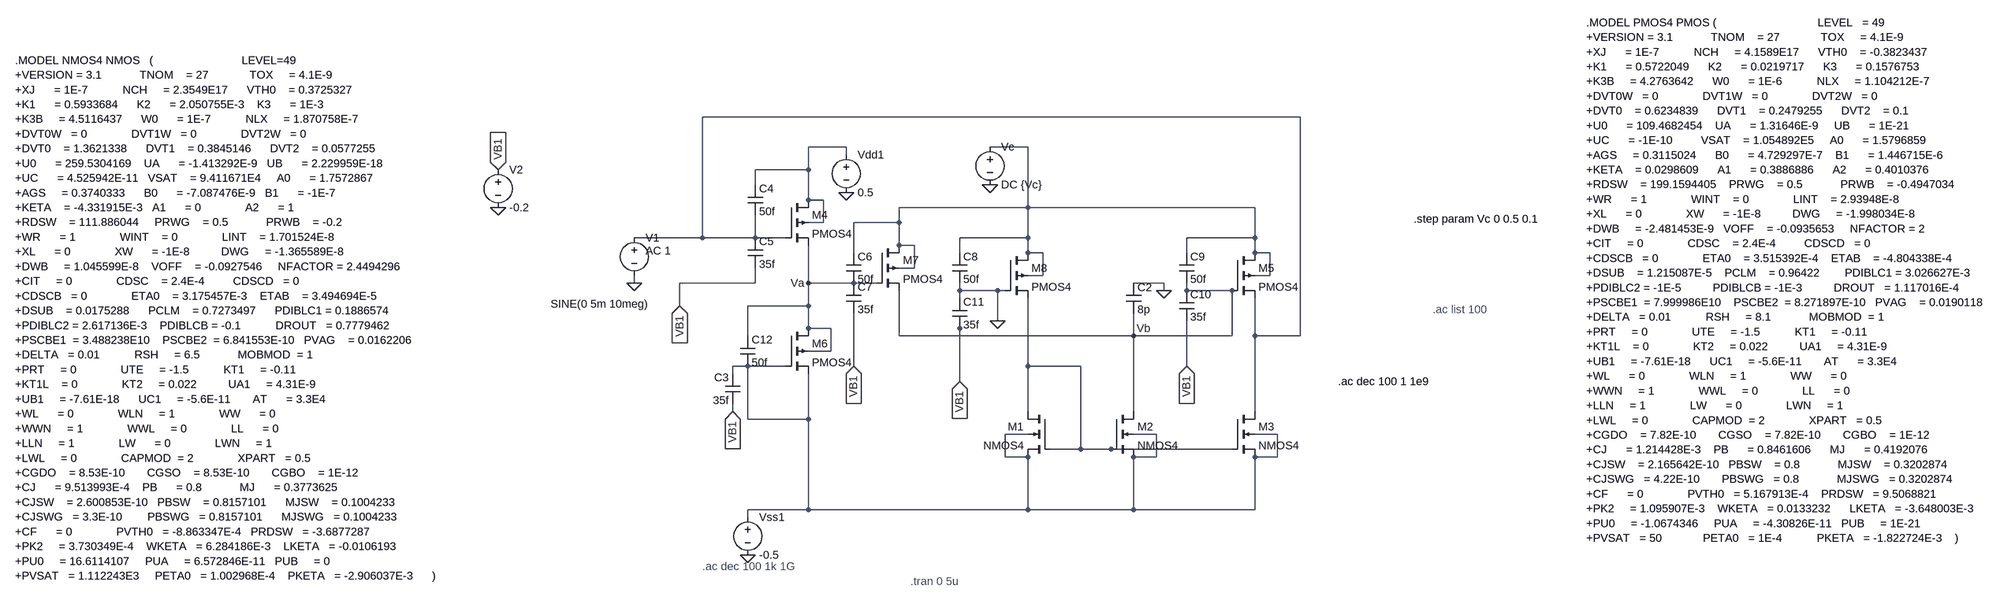
[diagram p0: schematic BPFilter_fgmos_tran.asc]
BPFilter_fgmos_tran.asc, the LTspice schematic file:
Version 4.1
SHEET 1 3080 808
WIRE 1280 -192 16 -192
WIRE 320 -128 240 -128
WIRE 704 -128 624 -128
WIRE 320 -112 320 -128
WIRE 240 -80 240 -128
WIRE 240 -80 128 -80
WIRE 128 -48 128 -80
WIRE 240 -16 240 -80
WIRE 272 -16 240 -16
WIRE 704 0 704 -128
WIRE 704 0 432 0
WIRE 1184 0 704 0
WIRE 272 32 272 -16
WIRE 272 32 240 32
WIRE 432 32 432 0
WIRE 432 32 336 32
WIRE 16 64 16 -192
WIRE 16 64 -128 64
WIRE 128 64 128 16
WIRE 128 64 16 64
WIRE 192 64 128 64
WIRE 704 64 704 0
WIRE 704 64 560 64
WIRE 1184 64 1184 0
WIRE 1184 64 1040 64
WIRE 432 80 432 32
WIRE 464 80 432 80
WIRE 336 96 336 32
WIRE 560 96 560 64
WIRE 704 96 704 64
WIRE 736 96 704 96
WIRE 1040 96 1040 64
WIRE 1184 96 1184 64
WIRE 1216 96 1184 96
WIRE 464 128 464 80
WIRE 464 128 432 128
WIRE 736 144 736 96
WIRE 736 144 704 144
WIRE 1216 144 1216 96
WIRE 1216 144 1184 144
WIRE -128 160 -128 144
WIRE 128 160 128 128
WIRE 128 160 -32 160
WIRE 240 160 240 80
WIRE 336 160 240 160
WIRE 384 160 336 160
WIRE 992 160 928 160
WIRE 560 176 560 160
WIRE 640 176 560 176
WIRE 656 176 640 176
WIRE 992 176 992 160
WIRE 1040 176 1040 160
WIRE 1136 176 1040 176
WIRE 560 192 560 176
WIRE -32 208 -32 160
WIRE 240 208 240 160
WIRE 240 208 112 208
WIRE 640 240 640 176
WIRE 240 256 240 208
WIRE 288 256 240 256
WIRE 560 256 560 240
WIRE 112 272 112 208
WIRE 432 272 432 176
WIRE 928 272 928 224
WIRE 928 272 432 272
WIRE 1136 272 1136 176
WIRE 1136 272 928 272
WIRE 1184 272 1184 192
WIRE 1280 272 1280 -192
WIRE 1280 272 1184 272
WIRE 288 304 288 256
WIRE 288 304 240 304
WIRE 112 336 80 336
WIRE 192 336 112 336
WIRE 336 336 336 224
WIRE 704 336 704 192
WIRE 816 336 704 336
WIRE 1040 336 1040 240
WIRE 80 352 80 336
WIRE 560 368 560 256
WIRE 80 432 80 416
WIRE 704 432 704 336
WIRE 928 432 928 272
WIRE 1184 432 1184 272
WIRE 112 448 112 336
WIRE 240 448 240 352
WIRE 240 448 112 448
WIRE 704 480 656 480
WIRE 976 480 928 480
WIRE 1232 480 1184 480
WIRE 816 512 816 336
WIRE 816 512 752 512
WIRE 880 512 816 512
WIRE 1136 512 880 512
WIRE 656 528 656 480
WIRE 704 528 656 528
WIRE 976 528 976 480
WIRE 976 528 928 528
WIRE 1232 528 1232 480
WIRE 1232 528 1184 528
WIRE 240 640 240 448
WIRE 240 640 112 640
WIRE 704 640 704 528
WIRE 704 640 240 640
WIRE 928 640 928 528
WIRE 928 640 704 640
WIRE 1184 640 1184 528
WIRE 1184 640 928 640
WIRE 112 656 112 640
FLAG 112 736 0
FLAG -128 160 0
FLAG 320 -32 0
FLAG 624 -48 0
FLAG 240 160 Va
FLAG 928 272 Vb
FLAG 992 176 0
FLAG -416 0 0
FLAG -416 -80 VB1
IOPIN -416 -80 In
FLAG -32 208 VB1
IOPIN -32 208 In
FLAG 80 432 VB1
IOPIN 80 432 In
FLAG 336 336 VB1
IOPIN 336 336 In
FLAG 560 368 VB1
IOPIN 560 368 In
FLAG 1040 336 VB1
IOPIN 1040 336 In
FLAG 640 240 0
SYMBOL nmos4 752 432 M0
SYMATTR InstName M1
SYMATTR Value2 l=1u w=10u
SYMATTR Value NMOS4
SYMBOL nmos4 880 432 R0
SYMATTR InstName M2
SYMATTR Value2 l=1u w=10u
SYMATTR Value NMOS4
SYMBOL nmos4 1136 432 R0
SYMATTR InstName M3
SYMATTR Value2 l=1u w=10u
SYMATTR Value NMOS4
SYMBOL voltage 112 640 R0
WINDOW 123 0 0 Left 0
WINDOW 39 0 0 Left 0
SYMATTR InstName Vss1
SYMATTR Value -0.5
SYMBOL voltage -128 48 R0
WINDOW 123 24 44 Left 2
WINDOW 39 0 0 Left 0
WINDOW 3 -177 156 Left 2
SYMATTR Value2 AC 1
SYMATTR Value SINE(0 5m 10meg)
SYMATTR InstName V1
SYMBOL pmos4 192 -16 R0
SYMATTR InstName M4
SYMATTR Value2 l=0.5u w=5u
SYMATTR Value PMOS4
SYMBOL pmos4 1136 96 R0
SYMATTR InstName M5
SYMATTR Value2 l=0.5u w=20u
SYMATTR Value PMOS4
SYMBOL voltage 320 -128 R0
WINDOW 123 0 0 Left 0
WINDOW 39 0 0 Left 0
SYMATTR InstName Vdd1
SYMATTR Value 0.5
SYMBOL pmos4 192 256 R0
SYMATTR InstName M6
SYMATTR Value2 l=0.5u w=5u
SYMATTR Value PMOS4
SYMBOL pmos4 384 80 R0
SYMATTR InstName M7
SYMATTR Value2 l=0.5u w=20u
SYMATTR Value PMOS4
SYMBOL pmos4 656 96 R0
SYMATTR InstName M8
SYMATTR Value2 l=0.5u w=20u
SYMATTR Value PMOS4
SYMBOL voltage 624 -144 R0
WINDOW 123 0 0 Left 0
WINDOW 39 0 0 Left 0
SYMATTR InstName Vc
SYMATTR Value DC {Vc}
SYMBOL cap 912 160 R0
WINDOW 0 24 9 Left 2
SYMATTR InstName C2
SYMATTR Value 8p
SYMBOL voltage -416 -96 R0
WINDOW 123 0 0 Left 0
WINDOW 39 0 0 Left 0
SYMATTR InstName V2
SYMATTR Value -0.2
SYMBOL cap 96 416 R180
WINDOW 0 24 56 Left 2
WINDOW 3 24 8 Left 2
SYMATTR InstName C3
SYMATTR Value 35f
SYMBOL cap 112 -48 R0
SYMATTR InstName C4
SYMATTR Value 50f
SYMBOL cap 112 64 R0
SYMATTR InstName C5
SYMATTR Value 35f
SYMBOL cap 320 96 R0
SYMATTR InstName C6
SYMATTR Value 50f
SYMBOL cap 320 160 R0
SYMATTR InstName C7
SYMATTR Value 35f
SYMBOL cap 544 96 R0
SYMATTR InstName C8
SYMATTR Value 50f
SYMBOL cap 1024 96 R0
SYMATTR InstName C9
SYMATTR Value 50f
SYMBOL cap 1024 176 R0
SYMATTR InstName C10
SYMATTR Value 35f
SYMBOL cap 544 192 R0
SYMATTR InstName C11
SYMATTR Value 35f
SYMBOL cap 96 272 R0
SYMATTR InstName C12
SYMATTR Value 50f
TEXT 16 760 Left 2 ;.ac dec 100 1k 1G
TEXT 456 792 Left 2 ;.tran 0 5u
TEXT -1544 -312 Left 2 !.MODEL NMOS4 NMOS   (                            LEVEL=49\n+VERSION = 3.1            TNOM    = 27             TOX     = 4.1E-9\n+XJ      = 1E-7           NCH     = 2.3549E17      VTH0    = 0.3725327\n+K1      = 0.5933684      K2      = 2.050755E-3    K3      = 1E-3\n+K3B     = 4.5116437      W0      = 1E-7           NLX     = 1.870758E-7\n+DVT0W   = 0              DVT1W   = 0              DVT2W   = 0\n+DVT0    = 1.3621338      DVT1    = 0.3845146      DVT2    = 0.0577255\n+U0      = 259.5304169    UA      = -1.413292E-9   UB      = 2.229959E-18\n+UC      = 4.525942E-11   VSAT    = 9.411671E4     A0      = 1.7572867\n+AGS     = 0.3740333      B0      = -7.087476E-9   B1      = -1E-7\n+KETA    = -4.331915E-3   A1      = 0              A2      = 1\n+RDSW    = 111.886044     PRWG    = 0.5            PRWB    = -0.2\n+WR      = 1              WINT    = 0              LINT    = 1.701524E-8\n+XL      = 0              XW      = -1E-8          DWG     = -1.365589E-8\n+DWB     = 1.045599E-8    VOFF    = -0.0927546     NFACTOR = 2.4494296\n+CIT     = 0              CDSC    = 2.4E-4         CDSCD   = 0\n+CDSCB   = 0              ETA0    = 3.175457E-3    ETAB    = 3.494694E-5\n+DSUB    = 0.0175288      PCLM    = 0.7273497      PDIBLC1 = 0.1886574\n+PDIBLC2 = 2.617136E-3    PDIBLCB = -0.1           DROUT   = 0.7779462\n+PSCBE1  = 3.488238E10    PSCBE2  = 6.841553E-10   PVAG    = 0.0162206\n+DELTA   = 0.01           RSH     = 6.5            MOBMOD  = 1\n+PRT     = 0              UTE     = -1.5           KT1     = -0.11\n+KT1L    = 0              KT2     = 0.022          UA1     = 4.31E-9\n+UB1     = -7.61E-18      UC1     = -5.6E-11       AT      = 3.3E4\n+WL      = 0              WLN     = 1              WW      = 0\n+WWN     = 1              WWL     = 0              LL      = 0\n+LLN     = 1              LW      = 0              LWN     = 1\n+LWL     = 0              CAPMOD  = 2              XPART   = 0.5\n+CGDO    = 8.53E-10       CGSO    = 8.53E-10       CGBO    = 1E-12\n+CJ      = 9.513993E-4    PB      = 0.8            MJ      = 0.3773625\n+CJSW    = 2.600853E-10   PBSW    = 0.8157101      MJSW    = 0.1004233\n+CJSWG   = 3.3E-10        PBSWG   = 0.8157101      MJSWG   = 0.1004233\n+CF      = 0              PVTH0   = -8.863347E-4   PRDSW   = -3.6877287\n+PK2     = 3.730349E-4    WKETA   = 6.284186E-3    LKETA   = -0.0106193\n+PU0     = 16.6114107     PUA     = 6.572846E-11   PUB     = 0\n+PVSAT   = 1.112243E3     PETA0   = 1.002968E-4    PKETA   = -2.906037E-3      )
TEXT 2192 -392 Left 2 !.MODEL PMOS4 PMOS (                                LEVEL   = 49\n+VERSION = 3.1            TNOM    = 27             TOX     = 4.1E-9\n+XJ      = 1E-7           NCH     = 4.1589E17      VTH0    = -0.3823437\n+K1      = 0.5722049      K2      = 0.0219717      K3      = 0.1576753\n+K3B     = 4.2763642      W0      = 1E-6           NLX     = 1.104212E-7\n+DVT0W   = 0              DVT1W   = 0              DVT2W   = 0\n+DVT0    = 0.6234839      DVT1    = 0.2479255      DVT2    = 0.1\n+U0      = 109.4682454    UA      = 1.31646E-9     UB      = 1E-21\n+UC      = -1E-10         VSAT    = 1.054892E5     A0      = 1.5796859\n+AGS     = 0.3115024      B0      = 4.729297E-7    B1      = 1.446715E-6\n+KETA    = 0.0298609      A1      = 0.3886886      A2      = 0.4010376\n+RDSW    = 199.1594405    PRWG    = 0.5            PRWB    = -0.4947034\n+WR      = 1              WINT    = 0              LINT    = 2.93948E-8\n+XL      = 0              XW      = -1E-8          DWG     = -1.998034E-8\n+DWB     = -2.481453E-9   VOFF    = -0.0935653     NFACTOR = 2\n+CIT     = 0              CDSC    = 2.4E-4         CDSCD   = 0\n+CDSCB   = 0              ETA0    = 3.515392E-4    ETAB    = -4.804338E-4\n+DSUB    = 1.215087E-5    PCLM    = 0.96422        PDIBLC1 = 3.026627E-3\n+PDIBLC2 = -1E-5          PDIBLCB = -1E-3          DROUT   = 1.117016E-4\n+PSCBE1  = 7.999986E10    PSCBE2  = 8.271897E-10   PVAG    = 0.0190118\n+DELTA   = 0.01           RSH     = 8.1            MOBMOD  = 1\n+PRT     = 0              UTE     = -1.5           KT1     = -0.11\n+KT1L    = 0              KT2     = 0.022          UA1     = 4.31E-9\n+UB1     = -7.61E-18      UC1     = -5.6E-11       AT      = 3.3E4\n+WL      = 0              WLN     = 1              WW      = 0\n+WWN     = 1              WWL     = 0              LL      = 0\n+LLN     = 1              LW      = 0              LWN     = 1\n+LWL     = 0              CAPMOD  = 2              XPART   = 0.5\n+CGDO    = 7.82E-10       CGSO    = 7.82E-10       CGBO    = 1E-12\n+CJ      = 1.214428E-3    PB      = 0.8461606      MJ      = 0.4192076\n+CJSW    = 2.165642E-10   PBSW    = 0.8            MJSW    = 0.3202874\n+CJSWG   = 4.22E-10       PBSWG   = 0.8            MJSWG   = 0.3202874\n+CF      = 0              PVTH0   = 5.167913E-4    PRDSW   = 9.5068821\n+PK2     = 1.095907E-3    WKETA   = 0.0133232      LKETA   = -3.648003E-3\n+PU0     = -1.0674346     PUA     = -4.30826E-11   PUB     = 1E-21\n+PVSAT   = 50             PETA0   = 1E-4           PKETA   = -1.822724E-3    )
TEXT 1520 24 Left 2 !.step param Vc 0 0.5 0.1
TEXT 1560 216 Left 2 ;.ac list 100
TEXT 1360 368 Left 2 !.ac dec 100 1 1e9

The netlist it stands for:
* BPFilter_fgmos_tran.asc
M1 N005 N005 N004 N004 NMOS4 l=1u w=10u
M2 Vb N005 N004 N004 NMOS4 l=1u w=10u
M3 N001 N005 N004 N004 NMOS4 l=1u w=10u
Vss1 N004 0 -0.5
V1 N001 0 SINE(0 5m 10meg) AC 1
M4 N002 N001 Va N002 PMOS4 l=0.5u w=5u
M5 N003 Vb N001 N003 PMOS4 l=0.5u w=20u
Vdd1 N002 0 0.5
M6 Va N004 N004 Va PMOS4 l=0.5u w=5u
M7 N003 Va Vb N003 PMOS4 l=0.5u w=20u
M8 N003 0 N005 N003 PMOS4 l=0.5u w=20u
Vc N003 0 DC {Vc}
C2 0 Vb 8p
V2 VB1 0 -0.2
C3 VB1 N004 35f
C4 N002 N001 50f
C5 N001 VB1 35f
C6 N003 Va 50f
C7 Va VB1 35f
C8 N003 0 50f
C9 N003 Vb 50f
C10 Vb VB1 35f
C11 0 VB1 35f
C12 Va N004 50f
.model NMOS NMOS
.model PMOS PMOS
.lib standard.mos
* .ac dec 100 1k 1G
* .tran 0 5u
.MODEL NMOS4 NMOS   (                            LEVEL=49
+VERSION = 3.1            TNOM    = 27             TOX     = 4.1E-9
+XJ      = 1E-7           NCH     = 2.3549E17      VTH0    = 0.3725327
+K1      = 0.5933684      K2      = 2.050755E-3    K3      = 1E-3
+K3B     = 4.5116437      W0      = 1E-7           NLX     = 1.870758E-7
+DVT0W   = 0              DVT1W   = 0              DVT2W   = 0
+DVT0    = 1.3621338      DVT1    = 0.3845146      DVT2    = 0.0577255
+U0      = 259.5304169    UA      = -1.413292E-9   UB      = 2.229959E-18
+UC      = 4.525942E-11   VSAT    = 9.411671E4     A0      = 1.7572867
+AGS     = 0.3740333      B0      = -7.087476E-9   B1      = -1E-7
+KETA    = -4.331915E-3   A1      = 0              A2      = 1
+RDSW    = 111.886044     PRWG    = 0.5            PRWB    = -0.2
+WR      = 1              WINT    = 0              LINT    = 1.701524E-8
+XL      = 0              XW      = -1E-8          DWG     = -1.365589E-8
+DWB     = 1.045599E-8    VOFF    = -0.0927546     NFACTOR = 2.4494296
+CIT     = 0              CDSC    = 2.4E-4         CDSCD   = 0
+CDSCB   = 0              ETA0    = 3.175457E-3    ETAB    = 3.494694E-5
+DSUB    = 0.0175288      PCLM    = 0.7273497      PDIBLC1 = 0.1886574
+PDIBLC2 = 2.617136E-3    PDIBLCB = -0.1           DROUT   = 0.7779462
+PSCBE1  = 3.488238E10    PSCBE2  = 6.841553E-10   PVAG    = 0.0162206
+DELTA   = 0.01           RSH     = 6.5            MOBMOD  = 1
+PRT     = 0              UTE     = -1.5           KT1     = -0.11
+KT1L    = 0              KT2     = 0.022          UA1     = 4.31E-9
+UB1     = -7.61E-18      UC1     = -5.6E-11       AT      = 3.3E4
+WL      = 0              WLN     = 1              WW      = 0
+WWN     = 1              WWL     = 0              LL      = 0
+LLN     = 1              LW      = 0              LWN     = 1
+LWL     = 0              CAPMOD  = 2              XPART   = 0.5
+CGDO    = 8.53E-10       CGSO    = 8.53E-10       CGBO    = 1E-12
+CJ      = 9.513993E-4    PB      = 0.8            MJ      = 0.3773625
+CJSW    = 2.600853E-10   PBSW    = 0.8157101      MJSW    = 0.1004233
+CJSWG   = 3.3E-10        PBSWG   = 0.8157101      MJSWG   = 0.1004233
+CF      = 0              PVTH0   = -8.863347E-4   PRDSW   = -3.6877287
+PK2     = 3.730349E-4    WKETA   = 6.284186E-3    LKETA   = -0.0106193
+PU0     = 16.6114107     PUA     = 6.572846E-11   PUB     = 0
+PVSAT   = 1.112243E3     PETA0   = 1.002968E-4    PKETA   = -2.906037E-3      )
.MODEL PMOS4 PMOS (                                LEVEL   = 49
+VERSION = 3.1            TNOM    = 27             TOX     = 4.1E-9
+XJ      = 1E-7           NCH     = 4.1589E17      VTH0    = -0.3823437
+K1      = 0.5722049      K2      = 0.0219717      K3      = 0.1576753
+K3B     = 4.2763642      W0      = 1E-6           NLX     = 1.104212E-7
+DVT0W   = 0              DVT1W   = 0              DVT2W   = 0
+DVT0    = 0.6234839      DVT1    = 0.2479255      DVT2    = 0.1
+U0      = 109.4682454    UA      = 1.31646E-9     UB      = 1E-21
+UC      = -1E-10         VSAT    = 1.054892E5     A0      = 1.5796859
+AGS     = 0.3115024      B0      = 4.729297E-7    B1      = 1.446715E-6
+KETA    = 0.0298609      A1      = 0.3886886      A2      = 0.4010376
+RDSW    = 199.1594405    PRWG    = 0.5            PRWB    = -0.4947034
+WR      = 1              WINT    = 0              LINT    = 2.93948E-8
+XL      = 0              XW      = -1E-8          DWG     = -1.998034E-8
+DWB     = -2.481453E-9   VOFF    = -0.0935653     NFACTOR = 2
+CIT     = 0              CDSC    = 2.4E-4         CDSCD   = 0
+CDSCB   = 0              ETA0    = 3.515392E-4    ETAB    = -4.804338E-4
+DSUB    = 1.215087E-5    PCLM    = 0.96422        PDIBLC1 = 3.026627E-3
+PDIBLC2 = -1E-5          PDIBLCB = -1E-3          DROUT   = 1.117016E-4
+PSCBE1  = 7.999986E10    PSCBE2  = 8.271897E-10   PVAG    = 0.0190118
+DELTA   = 0.01           RSH     = 8.1            MOBMOD  = 1
+PRT     = 0              UTE     = -1.5           KT1     = -0.11
+KT1L    = 0              KT2     = 0.022          UA1     = 4.31E-9
+UB1     = -7.61E-18      UC1     = -5.6E-11       AT      = 3.3E4
+WL      = 0              WLN     = 1              WW      = 0
+WWN     = 1              WWL     = 0              LL      = 0
+LLN     = 1              LW      = 0              LWN     = 1
+LWL     = 0              CAPMOD  = 2              XPART   = 0.5
+CGDO    = 7.82E-10       CGSO    = 7.82E-10       CGBO    = 1E-12
+CJ      = 1.214428E-3    PB      = 0.8461606      MJ      = 0.4192076
+CJSW    = 2.165642E-10   PBSW    = 0.8            MJSW    = 0.3202874
+CJSWG   = 4.22E-10       PBSWG   = 0.8            MJSWG   = 0.3202874
+CF      = 0              PVTH0   = 5.167913E-4    PRDSW   = 9.5068821
+PK2     = 1.095907E-3    WKETA   = 0.0133232      LKETA   = -3.648003E-3
+PU0     = -1.0674346     PUA     = -4.30826E-11   PUB     = 1E-21
+PVSAT   = 50             PETA0   = 1E-4           PKETA   = -1.822724E-3    )
.step param Vc 0 0.5 0.1
* .ac list 100
.ac dec 100 1 1e9
.backanno
.end